# Altium project V3.PrjPcb (part 3 of 4)
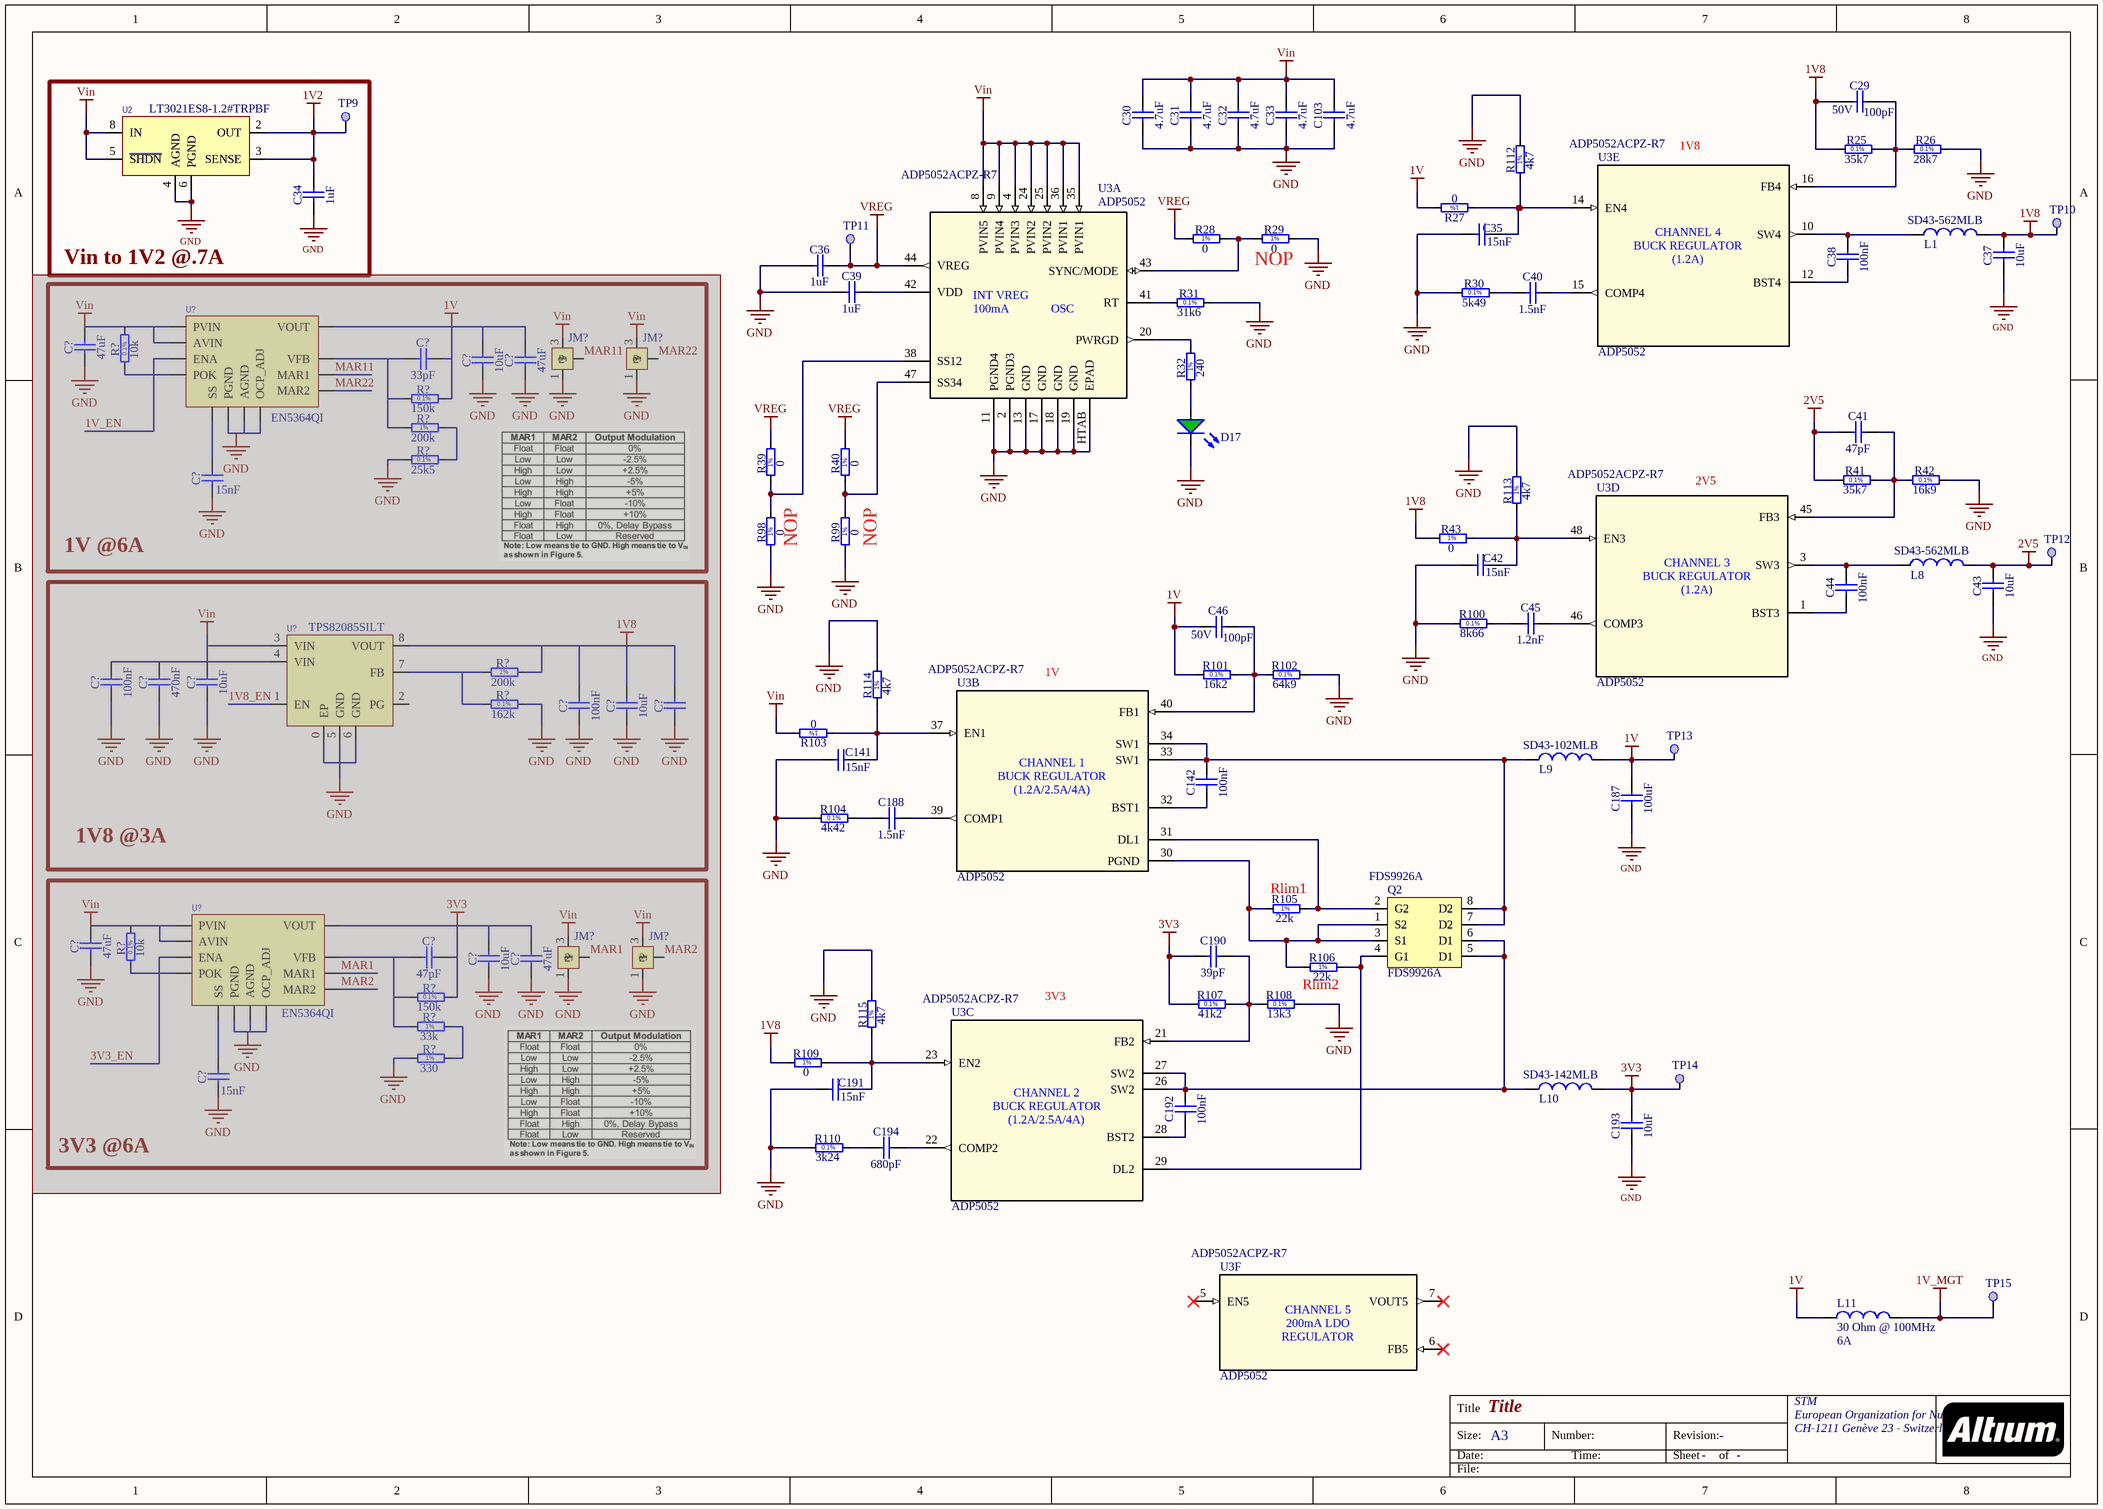
[diagram p6: Power.SchDoc]

## Sheet Power.SchDoc: Title (continued)
### Library data of the parts
C29 C46 = CC0603_100PF_50V_5%_NP0: Non-polarised capacitor; Part Description: SMD Multilayer Chip Ceramic Capacitor; Manufacturer: Kemet; Manufacturer Part Number: C0603C101J5GACTU; Manufacturer1 Part Number: 223886715101; TC: NP0; Tolerance: ±5%; Table: Capacitors SMD; Description: CAP CER 100PF 50V NP0 0603; Temperature Coefficient: C0G, NP0; Part Number: CC0603_100PF_50V_5%_NP0; Component Kind: Standard; Component Type: Standard; Pin Count: 2; Value: 100pF; Status: Preferred; Case: 0603; Mounted: Yes; Socket: No; SMD: Yes; Manufacturer1 Example: PHYCOMP; Manufacturer1 ComponentHeight: 0.87mm; HelpURL: \\cern.ch\dfs\Applications\Altium\Datasheets\CC0603_NP0_PHYCOMP.pdf; Author: CERN DEM JLC; CreateDate: 03.12.2007; LatestRevisionDate: 03.12.2007; Thickness (Max): 0.034" (0.87mm); Package / Case: 0603 (1608 Metric); Applications: General Purpose; Lead Style: -; Ratings: -; Packaging: Digi-Reel®; Category: Capacitors; RoHS: RoHS Compliant; Operating Temperature: -55°C ~ 125°C; Supplier: Digi-Key; Mounting Type: Surface Mount, MLCC; Features: Low ESL; Supplier Part Number: 399-1061-6-ND; Voltage - Rated: 50V; Size / Dimension: 0.063" L x 0.031" W (1.60mm x 0.80mm); Height - Seated (Max): -; Capacitance: 100pF; Lead Spacing: -
C30-C33 C103 = CC0805_4.7UF_10V_10%_X5R: Non-polarised capacitor; Part Description: SMD Multilayer Chip Ceramic Capacitor; Manufacturer: TDK; Manufacturer Part Number: C2012X7R1E475K125AB; Manufacturer1 Part Number: 222224013672; Voltage: 10V; TC: X5R; Tolerance: ±10%; Table: Capacitors SMD; SVHC: No SVHC (15-Jun-2015)<!--FANDB--><div class="features-and-benefits-container"><div class="features-and-benefits-description"><span class="features-benefits-value">The TDK C series commercial grade multilayer ceramic chip capacitor is Class 2, X7R dielectric material with perfect layering technique which ensures the precise placing of dielectric and electrode layers as well as the multilayer technology. High capacitance has been achieved through precision technologies that enable the use of multiple thinner ceramic dielectric layers. Typical applications include smoothing and decoupling circuits.</span></div><div class="features-and-benefits-list"><ul class="features-and-benefits-list-list"><li class="features-and-benefits-list-item">Capacitance values ranging from 0.5pF to 100µF based on dielectric material</li><li class="features-and-benefits-list-item">Case sizes 0402, 0603, 1005, 1608, 2012, 3216, 3225, 4532 and 5750 are available</li><li class="features-and-benefits-list-item">DC voltage rating of 4V to 50V</li><li class="features-and-benefits-list-item">Low ESL and excellent frequency characteristics</li><li class="features-and-benefits-list-item">Low self heating and high ripple resistance due to low ESR</li><li class="features-and-benefits-list-item">High temperature range of -55°C to 125; Capacitance: 4.7; Voltage Rating: 25; Product Range: C Series; Capacitance Tolerance: ± 10%; Ceramic Capacitor Case: 0805 [2012 Metric]; Dielectric Characteristic: X7; Description: TDK - C2012X7R1E475K125AB - CAP, MLCC, X7R, 4.7UF, 25V, 0805; Part Number: CC0805_4.7UF_10V_10%_X5R; Component Kind: Standard; Component Type: Standard; Pin Count: 2; Value: 4.7uF; Status: Preferred; Case: 0805; Mounted: Yes; Socket: No; SMD: Yes; Manufacturer1 Example: PHYCOMP; Manufacturer1 ComponentHeight: 1.45mm; HelpURL: \\cern.ch\dfs\Applications\Altium\Datasheets\CC0805_X5R_PHYCOMP_HC.pdf; Author: CERN DEM JLC; CreateDate: 03.12.2007; LatestRevisionDate: 03.12.2007; Operating Temperature Max: 125; Supplier Part Number: 2346943; RoHS: YES; Packaging: Cut Tape; Supplier: Farnell; Operating Temperature Min: -55; MSL: -
C34 = CC0603_1UF_25V_10%_X7R: Non-polarised capacitor; Part Description: SMD Multilayer Chip Ceramic Capacitor; Manufacturer: Murata Electronics North America; Manufacturer Part Number: GRM188R71E105KA12D; Voltage: 25V; TC: X7R; Tolerance: ±10%; Table: Capacitors SMD; Capacitance: 1µF; Description: CAP CER 1UF 25V X7R 0603; Part Number: CC0603_1UF_25V_10%_X7R; Component Kind: Standard; Component Type: Standard; Pin Count: 2; Value: 1uF; Status: None; Case: 0603; Mounted: Yes; Socket: No; SMD: Yes; Manufacturer1 Example: MURATA; Manufacturer1 Part Number: GRM188R71E105KA12D; Manufacturer1 ComponentHeight: 0.9mm; HelpURL: \\cern.ch\dfs\Applications\Altium\Datasheets\CC0603_X7R_MURATA.pdf; Author: CERN DEM JLC; CreateDate: 18.01.2011; LatestRevisionDate: 18.01.2011; Supplier Part Number: 490-5307-1-ND; Lead Style: -; Size / Dimension: 0.063" L x 0.031" W (1.60mm x 0.80mm); Mounting Type: Surface Mount, MLCC; Package / Case: 0603 (1608 Metric); Ratings: -; Operating Temperature: -55°C ~ 125°C; Category: Capacitors; Applications: General Purpose; Packaging: Cut Tape (CT); Features: -; Thickness (Max): 0.035" (0.90mm); Voltage - Rated: 25V; Temperature Coefficient: X7R; Height - Seated (Max): -; Supplier: Digi-Key; RoHS: RoHS Compliant; Lead Spacing: -
C35 C42 C141 C191 = CC0603_15NF_50V_10%_X7R: Non-polarised capacitor; Part Description: SMD Multilayer Chip Ceramic Capacitor; Manufacturer: AVX; Manufacturer Part Number: 06035C153KAZ2A; Manufacturer1 Part Number: 223858615638; Voltage: 50V; TC: X7R; Tolerance: ±10%; Table: Capacitors SMD; Dielectric Characteristic: X7; External Width: 1.6; Capacitance Tolerance: ± 10%; Product Range: FLEXITERM Series; External Depth: 0.81; No. of Pins: 2; SVHC: No SVHC (17-Dec-2015); Voltage Rating: 50; External Length / Height: 0.35; Capacitance: 0.015; Description: AVX - 06035C153KAZ2A - CAP, MLCC, X7R, 15NF, 50V, 0603; Ceramic Capacitor Case: 0603 [1608 Metric]; Capacitor Terminals: SMD; Part Number: CC0603_15NF_50V_10%_X7R; Component Kind: Standard; Component Type: Standard; Pin Count: 2; Value: 15nF; Status: Preferred; Case: 0603; Mounted: Yes; Socket: No; SMD: Yes; Manufacturer1 Example: PHYCOMP; Manufacturer1 ComponentHeight: 0.87mm; HelpURL: \\cern.ch\dfs\Applications\Altium\Datasheets\CC0603_X7R_PHYCOMP.pdf; Author: CERN DEM JLC; CreateDate: 3.12.2007; LatestRevisionDate: 3.12.2007; Capacitance Tolerance ±: ± 10%; Supplier: Farnell; RoHS: YES; Packaging: Cut Tape; Operating Temperature Max: 125; Operating Temperature Range: -55°C to +125°C<!--FANDB--><div class="features-and-benefits-container"><div class="features-and-benefits-description"><span class="features-benefits-value">The AVX FLEXITERM commercial MLCC are multilayer ceramic chip capacitors with X7R dielectric material and flexible terminations. The capacitance value ranges from 100pF to 22?F. FLEXITERM is designed to enhance mechanical flexure and temperature cycling performance of a standard ceramic capacitor. The industry standard for flexure is 2mm, FLEXITERM provides up to 5mm of flexure without internal cracks. These capacitors provide improved performance compared to standard termination capacitors. Typical applications include high flexure stress circuit boards and engine sensors.</span></div><div class="features-and-benefits-list"><ul class="features-and-benefits-list-list"><li class="features-and-benefits-list-item">EIA 0603, 0805, 1206, 1210, 1812, 2220 case sizes available</li><li class="features-and-benefits-list-item">Rated voltage of 10VDC, 16VDC, 25VDC, 50VDC, 100VDC and 200VDC</li><li class="features-and-benefits-list-item">±5%, ±10% and ±20% tolerance</li><li class="features-and-benefits-list-item">Flexible termination system</li><li class="features-and-benefits-list-item">Reduction in circuit board flex failures</li><li class="features-and-benefits-list-item">Soft termination offers improved reliability performance</li><li class="features-and-benefits-list-item">Operating temperature range -55°C to 125; Supplier Part Number: 1740537; Operating Temperature Min: -55; MSL: MSL 1 - Unlimited
C36 C39 = CC0603_1UF_16V_10%_X7R: Non-polarised capacitor; Part Description: SMD Multilayer Chip Ceramic Capacitor; Manufacturer: Murata Electronics North America; Manufacturer Part Number: GRM188R71E105KA12D; Manufacturer1 Part Number: 223824613663; Voltage: 16V; TC: X7R; Tolerance: ±10%; Table: Capacitors SMD; Capacitance: 1µF; Voltage - Rated: 25V; Description: CAP CER 1UF 25V X7R 0603; Part Number: CC0603_1UF_16V_10%_X7R; Component Kind: Standard; Component Type: Standard; Pin Count: 2; Value: 1uF; Status: Preferred; Case: 0603; Mounted: Yes; Socket: No; SMD: Yes; Manufacturer1 Example: PHYCOMP; Manufacturer1 ComponentHeight: 0.87mm; HelpURL: \\cern.ch\dfs\Applications\Altium\Datasheets\CC0805_X5R_PHYCOMP_HC.pdf; Author: CERN DEM JLC; CreateDate: 03.12.2007; LatestRevisionDate: 03.12.2007; Supplier Part Number: 490-5307-1-ND; Lead Style: -; Size / Dimension: 0.063" L x 0.031" W (1.60mm x 0.80mm); Mounting Type: Surface Mount, MLCC; Package / Case: 0603 (1608 Metric); Ratings: -; Operating Temperature: -55°C ~ 125°C; Category: Capacitors; Applications: General Purpose; Packaging: Cut Tape (CT); Features: -; Thickness (Max): 0.035" (0.90mm); Temperature Coefficient: X7R; Height - Seated (Max): -; Supplier: Digi-Key; RoHS: RoHS Compliant; Lead Spacing: -
C37 C43 C193 = CC1206_10UF_16V_10%_X7R: Non-polarised capacitor; Part Description: SMD Multilayer Chip Ceramic Capacitor; Manufacturer: Kemet; Manufacturer Part Number: C1206C106K4RACTU; Manufacturer1 Part Number: C1206C106K4RAC; Voltage: 16V; TC: X7R; Tolerance: ±10%; Table: Capacitors SMD; Description: CAP CER 10UF 16V X7R 1206; Capacitance: 10µF; Part Number: CC1206_10UF_16V_10%_X7R; Component Kind: Standard; Component Type: Standard; Pin Count: 2; Value: 10uF; Status: Preferred; Case: 1206; Mounted: Yes; Socket: No; SMD: Yes; Manufacturer1 Example: KEMET; Manufacturer1 ComponentHeight: 1.8mm; HelpURL: \\cern.ch\dfs\Applications\Altium\Datasheets\CC1206_X7R_KEMET.pdf; Author: CERN DEM JLC; CreateDate: 28.04.2009; LatestRevisionDate: 28.04.2009; Operating Temperature: -55°C ~ 125°C; Category: Capacitors; Temperature Coefficient: X7R; Thickness (Max): 0.071" (1.80mm); Lead Style: -; Ratings: -; Lead Spacing: -; Height - Seated (Max): -; Applications: General Purpose; Size / Dimension: 0.126" L x 0.063" W (3.20mm x 1.60mm); Voltage - Rated: 16V; Supplier Part Number: 399-3525-1-ND; RoHS: RoHS Compliant; Mounting Type: Surface Mount, MLCC; Package / Case: 1206 (3216 Metric); Packaging: Cut Tape (CT); Features: -; Supplier: Digi-Key
C38 C44 C142 C192 = CC0603_100NF_50V_10%_X7R: Non-polarised capacitor; Part Description: SMD Multilayer Chip Ceramic Capacitor; Manufacturer: MULTICOMP; Manufacturer Part Number: MCB0603R104KCT; Manufacturer1 Part Number: 223858615649; Voltage: 50V; TC: X7R; Tolerance: ±10%; Table: Capacitors SMD; Voltage Rating: 16; Capacitance Tolerance ±: ± 10%; Dielectric Characteristic: X7; Capacitance: 0.1; Description: MULTICOMP - MCB0603R104KCT - CAP, MLCC, X7R, 100NF, 16V, 0603; SVHC: No SVHC (17-Dec-2015); Capacitor Terminals: SMD; Ceramic Capacitor Case: 0603 [1608 Metric]; Product Range: MCB Series; Part Number: CC0603_100NF_50V_10%_X7R; Component Kind: Standard; Component Type: Standard; Pin Count: 2; Value: 100nF; Status: Preferred; Case: 0603; Mounted: Yes; Socket: No; SMD: Yes; Manufacturer1 Example: PHYCOMP; Manufacturer1 ComponentHeight: 0.87mm; HelpURL: \\cern.ch\dfs\Applications\Altium\Datasheets\CC0603_X7R_PHYCOMP.pdf; Author: CERN DEM JLC; CreateDate: 03.12.2007; LatestRevisionDate: 03.12.2007; Supplier: Farnell; Capacitance Tolerance: ± 10%; Supplier Part Number: 9406140; RoHS: YES; Packaging: Cut Tape; MSL: -; Operating Temperature Max: 125; Operating Temperature Range: -55°C to +125°C<!--FANDB--><div class="features-and-benefits-container"><div class="features-and-benefits-description"><span class="features-benefits-value">The MCB0603R104KCT is a multilayer Ceramic Capacitor with 0603 chip, for general digital circuit. Consists of a conducting material and electrodes. To manufacture a chip-type SMT and achieve miniaturization, high density and high efficiency, ceramic condensers are used. MLCC is made by X7; Operating Temperature Min: -55
C40 = CC0603_1.5NF_50V_10%_X7R: Non-polarised capacitor; Part Description: SMD Multilayer Chip Ceramic Capacitor; Manufacturer: MULTICOMP; Manufacturer Part Number: MC0603B152K500CT; Manufacturer1 Part Number: 223858615625; Voltage: 50V; TC: X7R; Tolerance: ±10%; Table: Capacitors SMD; Capacitance Tolerance: ± 10%; Capacitance: 1500; Dielectric Characteristic: X7; External Depth: 1.6; SVHC: No SVHC (17-Dec-2015); No. of Pins: 2; Voltage Rating: 50; Product Range: MC Series; Ceramic Capacitor Case: 0603 [1608 Metric]; Capacitor Terminals: SMD; External Width: 0.8; Description: MULTICOMP - MC0603B152K500CT - CAP, MLCC, X7R, 1.5NF, 50V, 0603; Part Number: CC0603_1.5NF_50V_10%_X7R; Component Kind: Standard; Component Type: Standard; Pin Count: 2; Value: 1.5nF; Status: Preferred; Case: 0603; Mounted: Yes; Socket: No; SMD: Yes; Manufacturer1 Example: PHYCOMP; Manufacturer1 ComponentHeight: 0.87mm; HelpURL: \\cern.ch\dfs\Applications\Altium\Datasheets\CC0603_X7R_PHYCOMP.pdf; Author: CERN DEM JLC; CreateDate: 3.12.2007; LatestRevisionDate: 3.12.2007; RoHS: YES; Operating Temperature Range: -55°C to +125°C<!--FANDB--><div class="features-and-benefits-container"><div class="features-and-benefits-description"><span class="features-benefits-value">The Multicomp MC series is general purpose MLCC capacitors with X7R dielectric material which provides high electrical precision, stability and reliability. This MLCC capacitor consists of a conducting material and electrodes with high density and high efficiency ceramic condensers.</span></div><div class="features-and-benefits-list"><ul class="features-and-benefits-list-list"><li class="features-and-benefits-list-item">Small size with higher capacitance values</li><li class="features-and-benefits-list-item">0201, 0402, 0603, 0805, 1206, 1210, 1812 case sizes available</li><li class="features-and-benefits-list-item">Capacitance value ranging from 100pF to 47?F</li><li class="features-and-benefits-list-item">Capacitor with lead free termination (pure Tin)</li><li class="features-and-benefits-list-item">High electrical precision, stability and reliability</li><li class="features-and-benefits-list-item">Rated voltage of 6.3V, 10V, 16V, 25V, 50V, 100V</li><li class="features-and-benefits-list-item">Operating temperature of -55°C to +125°C</li><li class="features-and-benefits-list-item">Available in ±5%, ±10% and ±20; MSL: -; Operating Temperature Max: 125; Packaging: Cut Tape; Operating Temperature Min: -55; Capacitance Tolerance ±: ± 10%; Supplier Part Number: 1759091; External Length / Height: 0.8; Supplier: Farnell
C41 = CC0603_47PF_50V_5%_NP0: Non-polarised capacitor; Part Description: SMD Multilayer Chip Ceramic Capacitor; Manufacturer: AVX Corporation; Manufacturer Part Number: 06031A470FAT2A; Manufacturer1 Part Number: 223886715479; Voltage: 50V; TC: NP0; Tolerance: ±1%; Table: Capacitors SMD; Temperature Coefficient: C0G, NP0; Description: CAP CER 47PF 100V NP0 0603; Voltage - Rated: 100V; Part Number: CC0603_47PF_50V_5%_NP0; Component Kind: Standard; Component Type: Standard; Pin Count: 2; Value: 47pF; Status: Preferred; Case: 0603; Mounted: Yes; Socket: No; SMD: Yes; Manufacturer1 Example: PHYCOMP; Manufacturer1 ComponentHeight: 0.87mm; HelpURL: \\cern.ch\dfs\Applications\Altium\Datasheets\CC0603_NP0_PHYCOMP.pdf; Author: CERN DEM JLC; CreateDate: 3.12.2007; LatestRevisionDate: 3.12.2007; Features: -; Lead Style: -; Mounting Type: Surface Mount, MLCC; Applications: General Purpose; Thickness (Max): 0.035" (0.90mm); Package / Case: 0603 (1608 Metric); Capacitance: 47pF; Category: Capacitors; Supplier Part Number: 478-3691-1-ND; Operating Temperature: -55°C ~ 125°C; Size / Dimension: 0.063" L x 0.032" W (1.60mm x 0.81mm); Ratings: -; Lead Spacing: -; Supplier: Digi-Key; Packaging: Cut Tape (CT); RoHS: RoHS Compliant; Height - Seated (Max): -
C45 = CPPS0603_1.2NF_16V_5%_PANASONIC_ECHU(X): Non-polarised capacitor; Part Description: Stacked Metallized PPS (Polyphenylene Sulfide) Film Chip Capacitor; Manufacturer: MULTICOMP; Manufacturer Part Number: MC0603B122K500CT; Voltage: 16V; Tolerance: ±5%; Table: Capacitors SMD; Capacitance Tolerance ±: ± 10%; External Depth: 1.6; External Width: 0.8; Capacitor Terminals: SMD; Description: MULTICOMP - MC0603B122K500CT - CAP, MLCC, X7R, 1.2NF, 50V, 0603; Voltage Rating: 50; Ceramic Capacitor Case: 0603 [1608 Metric]; Dielectric Characteristic: X7; SVHC: No SVHC (17-Dec-2015); Capacitance: 1200; Product Range: MC Series; No. of Pins: 2; Part Number: CPPS0603_1.2NF_16V_5%_PANASONIC_ECHU(X); Component Kind: Standard; Component Type: Standard; Pin Count: 2; Value: 1.2nF; Status: None; Case: 0603; Mounted: Yes; Socket: No; SMD: Yes; HelpURL: \\cern.ch\dfs\Applications\Altium\Datasheets\CPPS0603_PANASONIC_ECHU(X).pdf; Author: CERN DEM JLC; CreateDate: 15.06.2011; LatestRevisionDate: 15.06.2011; ComponentHeight: 0.85mm; Supplier: Farnell; Supplier Part Number: 1759090; Operating Temperature Max: 125; Packaging: Cut Tape; MSL: -; Capacitance Tolerance: ± 10%; Operating Temperature Range: -55°C to +125; External Length / Height: 0.8; Operating Temperature Min: -55; RoHS: YES
C187 = CC1210_100UF_6.3V_20%_X5R: Non-polarised capacitor; Part Description: SMD Multilayer Chip Ceramic Capacitor; Manufacturer: Murata Electronics North America; Manufacturer Part Number: GRM32ER60J107ME20L; Voltage: 6.3V; TC: X5R; Tolerance: ±20%; Table: Capacitors SMD; Capacitance: 100µF; Description: CAP CER 100UF 6.3V X5R 1210; Part Number: CC1210_100UF_6.3V_20%_X5R; Component Kind: Standard; Component Type: Standard; Pin Count: 2; Value: 100uF; Status: Preferred; Case: 1210; Mounted: Yes; Socket: No; SMD: Yes; Manufacturer1 Example: MURATA; Manufacturer1 Part Number: GRM32ER60J107ME20L; Manufacturer1 ComponentHeight: 2.70mm; HelpURL: \\cern.ch\dfs\Applications\Altium\Datasheets\CC1210_X5R_MURATA.pdf; Author: CERN DEM JLC; CreateDate: 19.04.2010; LatestRevisionDate: 19.04.2010; Supplier: Digi-Key; Thickness (Max): 0.106" (2.70mm); Package / Case: 1210 (3225 Metric); Supplier Part Number: 490-3390-2-ND; Features: -; Mounting Type: Surface Mount, MLCC; Operating Temperature: -55°C ~ 85°C; Applications: General Purpose; Size / Dimension: 0.126" L x 0.098" W (3.20mm x 2.50mm); Category: Capacitors; Lead Style: -; Height - Seated (Max): -; Lead Spacing: -; RoHS: RoHS Compliant; Temperature Coefficient: X5R; Voltage - Rated: 6.3V; Packaging: Tape & Reel (TR); Ratings: -
C188 = CC0603_1.5NF_50V_5%_NP0: Non-polarised capacitor; Part Description: SMD Multilayer Chip Ceramic Capacitor; Manufacturer: KEMET; Manufacturer Part Number: C0603C152K5RACTU; Manufacturer1 Part Number: GRM1885C1H152JA01D; Voltage: 50V; TC: NP0; Tolerance: ±5%; Table: Capacitors SMD; Description: KEMET - C0603C152K5RACTU - CAP, MLCC, X7R, 1.5NF, 50V, 0603; Part Number: CC0603_1.5NF_50V_5%_NP0; Component Kind: Standard; Component Type: Standard; Pin Count: 2; Value: 1.5nF; Status: None; Case: 0603; Mounted: Yes; Socket: No; SMD: Yes; Manufacturer1 Example: MURATA; Manufacturer1 ComponentHeight: 0.9mm; HelpURL: \\cern.ch\dfs\Applications\Altium\Datasheets\CC0603_NP0_MURATA.pdf; Author: CERN DEM JLC; CreateDate: 08.02.2011; LatestRevisionDate: 08.02.2011; Supplier: Farnell; RoHS: YES; Supplier Part Number: 1414617
C190 = CC0603_39PF_50V_5%_NP0: Non-polarised capacitor; Part Description: SMD Multilayer Chip Ceramic Capacitor; Manufacturer: AVX Corporation; Manufacturer Part Number: 06031A390FAT2A; Manufacturer1 Part Number: 223886715399; Voltage: 50V; TC: NP0; Tolerance: ±1%; Table: Capacitors SMD; Temperature Coefficient: C0G, NP0; Description: CAP CER 39PF 100V NP0 0603; Voltage - Rated: 100V; Part Number: CC0603_39PF_50V_5%_NP0; Component Kind: Standard; Component Type: Standard; Pin Count: 2; Value: 39pF; Status: Preferred; Case: 0603; Mounted: Yes; Socket: No; SMD: Yes; Manufacturer1 Example: PHYCOMP; Manufacturer1 ComponentHeight: 0.87mm; HelpURL: \\cern.ch\dfs\Applications\Altium\Datasheets\CC0603_NP0_PHYCOMP.pdf; Author: CERN DEM JLC; CreateDate: 03.12.2007; LatestRevisionDate: 03.12.2007; RoHS: RoHS Compliant; Thickness (Max): 0.035" (0.90mm); Features: -; Package / Case: 0603 (1608 Metric); Supplier Part Number: 478-5773-1-ND; Lead Style: -; Supplier: Digi-Key; Category: Capacitors; Lead Spacing: -; Capacitance: 39pF; Size / Dimension: 0.063" L x 0.032" W (1.60mm x 0.81mm); Packaging: Cut Tape (CT); Operating Temperature: -55°C ~ 125°C; Applications: General Purpose; Mounting Type: Surface Mount, MLCC; Ratings: -; Height - Seated (Max): -
C194 = CC0603_680PF_50V_5%_NP0: Non-polarised capacitor; Part Description: SMD Multilayer Chip Ceramic Capacitor; Manufacturer: Kemet; Manufacturer Part Number: C0603C681F5GACTU; Manufacturer1 Part Number: 223886715681; Voltage: 50V; TC: NP0; Tolerance: ±1%; Table: Capacitors SMD; Description: CAP CER 680PF 50V NP0 0603; Temperature Coefficient: C0G, NP0; Part Number: CC0603_680PF_50V_5%_NP0; Component Kind: Standard; Component Type: Standard; Pin Count: 2; Value: 680pF; Status: Preferred; Case: 0603; Mounted: Yes; Socket: No; SMD: Yes; Manufacturer1 Example: PHYCOMP; Manufacturer1 ComponentHeight: 0.87mm; HelpURL: \\cern.ch\dfs\Applications\Altium\Datasheets\CC0603_NP0_PHYCOMP.pdf; Author: CERN DEM JLC; CreateDate: 03.12.2007; LatestRevisionDate: 03.12.2007; RoHS: RoHS Compliant; Voltage - Rated: 50V; Size / Dimension: 0.063" L x 0.031" W (1.60mm x 0.80mm); Supplier Part Number: 399-7948-1-ND; Lead Spacing: -; Packaging: Cut Tape (CT); Supplier: Digi-Key; Features: Low ESL; Thickness (Max): 0.034" (0.87mm); Ratings: -; Mounting Type: Surface Mount, MLCC; Height - Seated (Max): -; Applications: General Purpose; Capacitance: 680pF; Lead Style: -; Package / Case: 0603 (1608 Metric); Operating Temperature: -55°C ~ 125°C; Category: Capacitors
C?#1 = CC0603_33PF_50V_5%_NP0: Non-polarised capacitor; Part Description: SMD Multilayer Chip Ceramic Capacitor; Manufacturer: GENERIC; Manufacturer1 Part Number: 223886715339; Voltage: 50V; TC: NP0; Tolerance: ±5%; Table: Capacitors SMD; Part Number: CC0603_33PF_50V_5%_NP0; Component Kind: Standard; Component Type: Standard; Pin Count: 2; Value: 33pF; Status: Preferred; Manufacturer Part Number: CC0603_33PF_50V_5%_NP0; Case: 0603; Mounted: Yes; Socket: No; SMD: Yes; Manufacturer1 Example: PHYCOMP; Manufacturer1 ComponentHeight: 0.87mm; HelpURL: \\cern.ch\dfs\Applications\Altium\Datasheets\CC0603_NP0_PHYCOMP.pdf; Author: CERN DEM JLC; CreateDate: 3.12.2007; LatestRevisionDate: 3.12.2007
C?#2 C?#4 C?#13 C?#15 = CC1210_47UF_10V_20%_X5R: Non-polarised capacitor; Part Description: SMD Multilayer Chip Ceramic Capacitor; Manufacturer: GENERIC; Manufacturer1 Part Number: LMK325BJ476MM-T; Voltage: 10V; TC: X5R; Tolerance: ±20%; Table: Capacitors SMD; Part Number: CC1210_47UF_10V_20%_X5R; Component Kind: Standard; Component Type: Standard; Pin Count: 2; Value: 47uF; Status: None; Manufacturer Part Number: CC1210_47UF_10V_20%_X5R; Case: 1210; Mounted: Yes; Socket: No; SMD: Yes; Manufacturer1 Example: TAIYO YUDEN; Manufacturer1 ComponentHeight: 2.7mm; HelpURL: \\cern.ch\dfs\Applications\Altium\Datasheets\CC1210_X5R_TAIYO-YUDEN_HIGH-VALUE.pdf; Author: CERN DEM JLC; CreateDate: 4.05.2011; LatestRevisionDate: 4.05.2011
C?#3 C?#8 C?#14 = CC0805_10UF_10V_10%_X7R: Non-polarised capacitor; Part Description: SMD Multilayer Chip Ceramic Capacitor; Manufacturer: GENERIC; Manufacturer1 Part Number: GRM21BR71A106KE51L; Voltage: 10V; TC: X7R; Tolerance: ±10%; Table: Capacitors SMD; Part Number: CC0805_10UF_10V_10%_X7R; Component Kind: Standard; Component Type: Standard; Pin Count: 2; Value: 10uF; Status: Preferred; Manufacturer Part Number: CC0805_10UF_10V_10%_X7R; Case: 0805; Mounted: Yes; Socket: No; SMD: Yes; Manufacturer1 Example: MURATA; Manufacturer1 ComponentHeight: 1.35mm; HelpURL: \\cern.ch\dfs\Applications\Altium\Datasheets\CC0805_X7R_MURATA.pdf; Author: CERN DEM JLC; CreateDate: 30.04.2012; LatestRevisionDate: 30.04.2012
C?#5 C?#16 = CC0603_15NF_50V_10%_X7R: Non-polarised capacitor; Part Description: SMD Multilayer Chip Ceramic Capacitor; Manufacturer: GENERIC; Manufacturer1 Part Number: 223858615638; Voltage: 50V; TC: X7R; Tolerance: ±10%; Table: Capacitors SMD; Part Number: CC0603_15NF_50V_10%_X7R; Component Kind: Standard; Component Type: Standard; Pin Count: 2; Value: 15nF; Status: Preferred; Manufacturer Part Number: CC0603_15NF_50V_10%_X7R; Case: 0603; Mounted: Yes; Socket: No; SMD: Yes; Manufacturer1 Example: PHYCOMP; Manufacturer1 ComponentHeight: 0.87mm; HelpURL: \\cern.ch\dfs\Applications\Altium\Datasheets\CC0603_X7R_PHYCOMP.pdf; Author: CERN DEM JLC; CreateDate: 3.12.2007; LatestRevisionDate: 3.12.2007
C?#6 C?#9 = CC0603_100NF_50V_10%_X7R: Non-polarised capacitor; Part Description: SMD Multilayer Chip Ceramic Capacitor; Manufacturer: GENERIC; Manufacturer1 Part Number: 223858615649; Voltage: 50V; TC: X7R; Tolerance: ±10%; Table: Capacitors SMD; Part Number: CC0603_100NF_50V_10%_X7R; Component Kind: Standard; Component Type: Standard; Pin Count: 2; Value: 100nF; Status: Preferred; Manufacturer Part Number: CC0603_100NF_50V_10%_X7R; Case: 0603; Mounted: Yes; Socket: No; SMD: Yes; Manufacturer1 Example: PHYCOMP; Manufacturer1 ComponentHeight: 0.87mm; HelpURL: \\cern.ch\dfs\Applications\Altium\Datasheets\CC0603_X7R_PHYCOMP.pdf; Author: CERN DEM JLC; CreateDate: 3.12.2007; LatestRevisionDate: 3.12.2007
C?#7 = CC0603_470NF_16V_10%_X5R: Non-polarised capacitor; Part Description: SMD Multilayer Chip Ceramic Capacitor; Manufacturer: GENERIC; Manufacturer1 Part Number: 223878613658; Voltage: 16V; TC: X5R; Tolerance: ±10%; Table: Capacitors SMD; Part Number: CC0603_470NF_16V_10%_X5R; Component Kind: Standard; Component Type: Standard; Pin Count: 2; Value: 470nF; Status: Preferred; Manufacturer Part Number: CC0603_470NF_16V_10%_X5R; Case: 0603; Mounted: Yes; Socket: No; SMD: Yes; Manufacturer1 Example: PHYCOMP; Manufacturer1 ComponentHeight: 0.87mm; HelpURL: \\cern.ch\dfs\Applications\Altium\Datasheets\CC0805_X5R_PHYCOMP_HC.pdf; Author: CERN DEM JLC; CreateDate: 3.12.2007; LatestRevisionDate: 3.12.2007
C?#10 = CC0603_10UF_6.3V_20%_X5R: Non-polarised capacitor; Part Description: SMD Multilayer Chip Ceramic Capacitor; Manufacturer: GENERIC; Manufacturer1 Part Number: C0603C106M9PAC; Voltage: 6.3V; TC: X5R; Tolerance: ±20%; Table: Capacitors SMD; Part Number: CC0603_10UF_6.3V_20%_X5R; Component Kind: Standard; Component Type: Standard; Pin Count: 2; Value: 10uF; Status: Preferred; Manufacturer Part Number: CC0603_10uF_6.3V_20%_X5R; Case: 0603; Mounted: Yes; Socket: No; SMD: Yes; Manufacturer1 Example: KEMET; Manufacturer1 ComponentHeight: 0.95mm; HelpURL: \\cern.ch\dfs\Applications\Altium\Datasheets\CC0603_X5R_KEMET.pdf; Author: CERN DEM JLC; CreateDate: 3.12.2007; LatestRevisionDate: 3.12.2007
C?#11 = CC0805_22UF_16V_10%_X5R: Non-polarised capacitor; Part Description: SMD Multilayer Chip Ceramic Capacitor; Manufacturer: GENERIC; Manufacturer1 Part Number: C2012X5R1C226KT; Voltage: 16V; TC: X5R; Tolerance: ±10%; Table: Capacitors SMD; Part Number: CC0805_22UF_16V_10%_X5R; Component Kind: Standard; Component Type: Standard; Pin Count: 2; Value: 22uF; Status: Preferred; Manufacturer Part Number: CC0805_22UF_16V_10%_X5R; Case: 0805; Mounted: Yes; Socket: No; SMD: Yes; Manufacturer1 Example: TDK; Manufacturer1 ComponentHeight: 1.35mm; HelpURL: \\cern.ch\dfs\Applications\Altium\Datasheets\CC0805_X5R_TDK_C.pdf; Author: CERN DEM JLC; CreateDate: 25.10.2012; LatestRevisionDate: 25.10.2012
C?#12 = CC0603_47PF_50V_5%_NP0: Non-polarised capacitor; Part Description: SMD Multilayer Chip Ceramic Capacitor; Manufacturer: GENERIC; Manufacturer1 Part Number: 223886715479; Voltage: 50V; TC: NP0; Tolerance: ±5%; Table: Capacitors SMD; Part Number: CC0603_47PF_50V_5%_NP0; Component Kind: Standard; Component Type: Standard; Pin Count: 2; Value: 47pF; Status: Preferred; Manufacturer Part Number: CC0603_47PF_50V_5%_NP0; Case: 0603; Mounted: Yes; Socket: No; SMD: Yes; Manufacturer1 Example: PHYCOMP; Manufacturer1 ComponentHeight: 0.87mm; HelpURL: \\cern.ch\dfs\Applications\Altium\Datasheets\CC0603_NP0_PHYCOMP.pdf; Author: CERN DEM JLC; CreateDate: 3.12.2007; LatestRevisionDate: 3.12.2007
D17 = LED0603: Diode, LED, 0603, Green; Manufacturer Part Number: 5988070100F; Manufacturer: Dialight; Current - Test: 20mA; Voltage - Forward (Vf) (Typ): 3.2V; Lens Transparency: Clear; Lens Style/Size: Rectangle with Flat Top, 1.10mm x 0.80mm; Lens Color: Colorless; Viewing Angle: 140°; Millicandela Rating: 20mcd; Wavelength - Dominant: 566nm; Category: Optoelectronics; Wavelength - Peak: -; Supplier: Digi-Key; Supplier Device Package: *; Height (Max): 0.70mm; Size / Dimension: 1.60mm L x 0.80mm W; Mounting Type: Surface Mount; RoHS: RoHS Compliant; Package / Case: 0603 (1608 Metric); Packaging: Cut Strip; Color: Green; Supplier Part Number: 5988070100F-ND
L1 L8 = SD43: Shilded SMD Power Inductors; Manufacturer: COILCRAFT; Inductance: 5.6; Product Range: SD43 Series; Power Inductor Case: 4.7mm x 4.2mm x 3.45; Saturation Current (Isat): 2.2; RMS Current (Irms): 2.8; DC Resistance Max: 0.101; Inductor Construction: Unshielded; Inductance Tolerance: ± 20%; RoHS: YES; Packaging: Cut Tape; MSL: MSL 1 - Unlimited<!--FANDB--><div class="features-and-benefits-container"></div>; Supplier Part Number: 2526966; Supplier: Farnell
L9 = SD43: Shilded SMD Power Inductors; Manufacturer: COILCRAFT; Inductance: 1; Saturation Current (Isat): 5.5; Product Range: SD43 Series; Inductance Tolerance: ± 20%; Inductor Construction: Unshielded; DC Resistance Max: 0.033; Power Inductor Case: 4.7mm x 4.2mm x 3.45; RMS Current (Irms): 5.8; RoHS: YES; Packaging: Cut Tape; MSL: MSL 1 - Unlimited<!--FANDB--><div class="features-and-benefits-container"></div>; Supplier: Farnell; Supplier Part Number: 2526946
L10 = SD43: Shilded SMD Power Inductors; Manufacturer: COILCRAFT; DC Resistance Max: 0.038; Inductance: 1.4; Inductance Tolerance: ± 20%; Inductor Construction: Unshielded; Product Range: SD43 Series; RMS Current (Irms): 5.8; Power Inductor Case: 4.7mm x 4.2mm x 3.45; Saturation Current (Isat): 4.8; RoHS: YES; MSL: MSL 1 - Unlimited<!--FANDB--><div class="features-and-benefits-container"></div>; Packaging: Cut Tape; Supplier Part Number: 2526951; Supplier: Farnell
L11 = MPZ2012S300AT000: FERRITE CHIP 30 OHM 6A 0805; Manufacturer: TDK Corporation; ESP: DSB; DC Resistance (DCR): 10 mOhm Max; Filter Type: Differential Mode - Single; Package: 0402-A; RS Stock Code: EL1724-0001; Package / Case: 0805 (2012 Metric); Supplier: Digi-Key; Size / Dimension: 0.079" L x 0.049" W (2.00mm x 1.25mm); Mounting Type: Surface Mount; RoHS: RoHS Compliant; Manufacturer Part Number: MPZ2012S300AT000; Category: Filters; Height (Max): 0.041" (1.05mm); Packaging: Cut Tape (CT); Supplier Part Number: 445-1566-1-ND
Q2 = FDS9926A: Manufacturer: Fairchild Semiconductor; Rds On (Max) @ Id, Vgs: 30 mOhm @ 6.5A, 4.5V; FET Feature: Logic Level Gate; FET Type: 2 N-Channel (Dual); Gate Charge (Qg) @ Vgs: 9nC @ 4.5V; Current - Continuous Drain (Id) @ 25°C: 6.5A; Drain to Source Voltage (Vdss): 20V; Description: MOSFET 2N-CH 20V 6.5A 8SOIC; Power - Max: 900mW; Vgs(th) (Max) @ Id: 1.5V @ 250µA; Input Capacitance (Ciss) @ Vds: 650pF @ 10V; Supplier: Digi-Key; Supplier Part Number: FDS9926ATR-ND; RoHS: RoHS Compliant; Package / Case: 8-SOIC (0.154", 3.90mm Width); Mounting Type: Surface Mount; Operating Temperature: -55°C ~ 150°C (TJ); Supplier Device Package: 8-SO; Category: Discrete Semiconductor Products; Packaging: Tape & Reel (TR); Manufacturer Part Number: FDS9926A
R25 = R0603_35K7_0.1%_0.063W_10PPM: Resistor - 0.1%; Part Description: Thin Film Chip Resistor; Manufacturer: VISHAY; Manufacturer Part Number: CRCW060335K7FKEA.; Manufacturer1 Part Number: RN73C1J35K7BTDF; Power: 0.063W; TC: ±10ppm; Table: Resistors SMD; Product Range: AEC-Q200 CRCW Series; Resistor Mounting: Surface Mount Device<!--FANDB--><div class="features-and-benefits-container"><div class="features-and-benefits-description"><span class="features-benefits-value">The Vishay D/CRCW e3 series are standard thick film chip resistors. The resistance range includes E96 and E24 decade values from 1ohm to 10Mohm. CRCW e3 series resistors have a pure tin solder contacts on the Ni barrier layer that provides compatibility with reflow soldering process.</span></div><div class="features-and-benefits-list"><ul class="features-and-benefits-list-list"><li class="features-and-benefits-list-item">Automotive grade AEC-Q200 qualified</li><li class="features-and-benefits-list-item">EIA 0402, 0603, 0805, 1206, 1210, 1218, 2010, 2512 standard case sizes available</li><li class="features-and-benefits-list-item">Stability &Delta; Temperature Coefficient: ± 100; Resistor Element Material: Thick Film; Voltage Rating: 75; Resistance Tolerance: ± 1%; Power Rating: 100; Resistance: 35.7; Description: VISHAY - CRCW060335K7FKEA. - RES, THICK FILM, 35K7, 1%, 0.1W, 0603; Resistor Case Style: 0603 [1608 Metric]; Part Number: R0603_35K7_0.1%_0.063W_10PPM; Component Kind: Standard; Component Type: Standard; Pin Count: 2; Value: 35k7; Status: Not recommended; Tolerance: ±0.1%; Case: 0603; Mounted: Yes; Socket: No; SMD: Yes; Manufacturer1 Example: TYCO HOLSWORTHY; Manufacturer1 ComponentHeight: 0.5mm; HelpURL: \\cern.ch\dfs\Applications\Altium\Datasheets\R0603_Tyco_RN73.pdf; Author: CERN DEM JLC; CreateDate: 3.12.2007; LatestRevisionDate: 13.03.2008; Supplier: Farnell; RoHS: Y-EX; MSL: MSL 1 - Unlimited; Supplier Part Number: 2138458; Packaging: Cut Tape
R26 = R0603_28K7_0.1%_0.063W_10PPM: Resistor - 0.1%; Part Description: Thin Film Chip Resistor; Manufacturer: Yageo; Manufacturer Part Number: RC0603FR-0728K7L; Manufacturer1 Part Number: RN73C1J28K7BTDF; Power: 0.063W; TC: ±10ppm; Tolerance: ±1%; Table: Resistors SMD; Temperature Coefficient: ±100ppm/°C; Resistance (Ohms): 28.7k; Power (Watts): 0.1W, 1/10W; Description: RES SMD 28.7K OHM 1% 1/10W 0603; Part Number: R0603_28K7_0.1%_0.063W_10PPM; Component Kind: Standard; Component Type: Standard; Pin Count: 2; Value: 28k7; Status: Not recommended; Case: 0603; Mounted: Yes; Socket: No; SMD: Yes; Manufacturer1 Example: TYCO HOLSWORTHY; Manufacturer1 ComponentHeight: 0.5mm; HelpURL: \\cern.ch\dfs\Applications\Altium\Datasheets\R0603_Tyco_RN73.pdf; Author: CERN DEM JLC; CreateDate: 3.12.2007; LatestRevisionDate: 13.03.2008; Package / Case: 0603 (1608 Metric); Category: Resistors; Height: 0.022" (0.55mm); Number of Terminations: 2; Packaging: Digi-Reel®; Supplier Part Number: 311-28.7KHRDKR-ND; Supplier Device Package: 0603; RoHS: RoHS Compliant; Size / Dimension: 0.063" L x 0.031" W (1.60mm x 0.80mm); Operating Temperature: -55°C ~ 155°C; Composition: Thick Film; Supplier: Digi-Key; Features: Moisture Resistant
R27-R29 R39 R40 R43 R98 R99 R103 R109 = R0603_0R_JUMPER: Resistor - 1%; Part Description: 1A (0.05R Max DC Resistance) Zero Ohm Jumper; Manufacturer: MULTICOMP; Manufacturer Part Number: MC0603SAF0000T5E; Manufacturer1 Part Number: NRC06Z0; Table: Resistors SMD; Description: MULTICOMP - MC0603SAF0000T5E - RES, THICK FILM, 0R, 1%, 0.1W, 0603; Part Number: R0603_0R_JUMPER; Component Kind: Standard; Component Type: Standard; Pin Count: 2; Value: 0; Status: Preferred; Case: 0603; Mounted: Yes; Socket: No; SMD: Yes; Manufacturer1 Example: NIC COMPONENT; Manufacturer1 ComponentHeight: 0.55mm; HelpURL: \\cern.ch\dfs\Applications\Altium\Datasheets\R0603_NIC_NRC.pdf; Author: CERN DEM JLC; CreateDate: 03.12.2007; LatestRevisionDate: 13.03.2008; Supplier Part Number: 2309111; Supplier: Farnell; RoHS: YES
R30 = R0603_5K49_0.1%_0.063W_10PPM: Resistor - 0.1%; Part Description: Thin Film Chip Resistor; Manufacturer: Yageo; Manufacturer Part Number: RC0603FR-075K49L; Manufacturer1 Part Number: RN73C1J5K49BTDF; Power: 0.063W; TC: ±10ppm; Tolerance: ±1%; Table: Resistors SMD; Power (Watts): 0.1W, 1/10W; Description: RES SMD 5.49K OHM 1% 1/10W 0603; Resistance (Ohms): 5.49k; Temperature Coefficient: ±100ppm/°C; Part Number: R0603_5K49_0.1%_0.063W_10PPM; Component Kind: Standard; Component Type: Standard; Pin Count: 2; Value: 5k49; Status: Not recommended; Case: 0603; Mounted: Yes; Socket: No; SMD: Yes; Manufacturer1 Example: TYCO HOLSWORTHY; Manufacturer1 ComponentHeight: 0.5mm; HelpURL: \\cern.ch\dfs\Applications\Altium\Datasheets\R0603_Tyco_RN73.pdf; Author: CERN DEM JLC; CreateDate: 3.12.2007; LatestRevisionDate: 13.03.2008; RoHS: RoHS Compliant; Package / Case: 0603 (1608 Metric); Category: Resistors; Operating Temperature: -55°C ~ 155°C; Supplier: Digi-Key; Size / Dimension: 0.063" L x 0.031" W (1.60mm x 0.80mm); Composition: Thick Film; Number of Terminations: 2; Packaging: Cut Tape (CT); Supplier Device Package: 0603; Supplier Part Number: 311-5.49KHRCT-ND; Features: Moisture Resistant; Height: 0.022" (0.55mm)
R31 = R0603_31K6_0.1%_0.063W_10PPM: Resistor - 0.1%; Part Description: Thin Film Chip Resistor; Manufacturer: Yageo; Manufacturer Part Number: RC0603FR-0731K6L; Manufacturer1 Part Number: RN73C1J31K6BTDF; Power: 0.063W; TC: ±10ppm; Tolerance: ±1%; Table: Resistors SMD; Description: RES SMD 31.6K OHM 1% 1/10W 0603; Power (Watts): 0.1W, 1/10W; Resistance (Ohms): 31.6k; Temperature Coefficient: ±100ppm/°C; Part Number: R0603_31K6_0.1%_0.063W_10PPM; Component Kind: Standard; Component Type: Standard; Pin Count: 2; Value: 31k6; Status: Not recommended; Case: 0603; Mounted: Yes; Socket: No; SMD: Yes; Manufacturer1 Example: TYCO HOLSWORTHY; Manufacturer1 ComponentHeight: 0.5mm; HelpURL: \\cern.ch\dfs\Applications\Altium\Datasheets\R0603_Tyco_RN73.pdf; Author: CERN DEM JLC; CreateDate: 03.12.2007; LatestRevisionDate: 13.03.2008; Composition: Thick Film; Number of Terminations: 2; Height: 0.022" (0.55mm); Size / Dimension: 0.063" L x 0.031" W (1.60mm x 0.80mm); Supplier Part Number: 311-31.6KHRCT-ND; Category: Resistors; Features: Moisture Resistant; Package / Case: 0603 (1608 Metric); Packaging: Cut Tape (CT); Supplier: Digi-Key; Supplier Device Package: 0603; RoHS: RoHS Compliant; Operating Temperature: -55°C ~ 155°C
R32 = R0603_240R_1%_0.1W_100PPM: Resistor - 1%; Part Description: General Purpose Thick Film Chip Resistor; Manufacturer: Yageo; Manufacturer Part Number: RC0603JR-07240RL; Manufacturer1 Part Number: NRC06F2400TRF; Power: 0.1W; TC: ±100ppm/°C; Tolerance: ±5%; Table: Resistors SMD; Description: RES SMD 240 OHM 5% 1/10W 0603; Power (Watts): 0.1W, 1/10W; Part Number: R0603_240R_1%_0.1W_100PPM; Component Kind: Standard; Component Type: Standard; Pin Count: 2; Value: 240; Status: Preferred; Case: 0603; Mounted: Yes; Socket: No; SMD: Yes; Manufacturer1 Example: NIC COMPONENT; Manufacturer1 ComponentHeight: 0.55mm; HelpURL: \\cern.ch\dfs\Applications\Altium\Datasheets\R0603_NIC_NRC.pdf; Author: CERN DEM JLC; CreateDate: 03.12.2007; LatestRevisionDate: 13.03.2008; Supplier Device Package: 0603; Temperature Coefficient: ±100ppm/°C; RoHS: RoHS Compliant; Category: Resistors; Supplier Part Number: 311-240GRCT-ND; Features: Moisture Resistant; Number of Terminations: 2; Height: 0.022" (0.55mm); Composition: Thick Film; Size / Dimension: 0.063" L x 0.031" W (1.60mm x 0.80mm); Package / Case: 0603 (1608 Metric); Packaging: Cut Tape (CT); Operating Temperature: -55°C ~ 155°C; Resistance (Ohms): 240; Supplier: Digi-Key
R41 = R0603_35K7_0.1%_0.063W_10PPM: Resistor - 0.1%; Part Description: Thin Film Chip Resistor; Manufacturer: VISHAY; Manufacturer Part Number: CRCW060335K7FKEA.; Manufacturer1 Part Number: RN73C1J35K7BTDF; Power: 0.063W; TC: ±10ppm; Table: Resistors SMD; Resistor Mounting: Surface Mount Device<!--FANDB--><div class="features-and-benefits-container"><div class="features-and-benefits-description"><span class="features-benefits-value">The Vishay D/CRCW e3 series are standard thick film chip resistors. The resistance range includes E96 and E24 decade values from 1ohm to 10Mohm. CRCW e3 series resistors have a pure tin solder contacts on the Ni barrier layer that provides compatibility with reflow soldering process.</span></div><div class="features-and-benefits-list"><ul class="features-and-benefits-list-list"><li class="features-and-benefits-list-item">Automotive grade AEC-Q200 qualified</li><li class="features-and-benefits-list-item">EIA 0402, 0603, 0805, 1206, 1210, 1218, 2010, 2512 standard case sizes available</li><li class="features-and-benefits-list-item">Stability &Delta; Resistance: 35.7; Resistor Element Material: Thick Film; Resistance Tolerance: ± 1%; Temperature Coefficient: ± 100; Voltage Rating: 75; Power Rating: 100; Resistor Case Style: 0603 [1608 Metric]; Product Range: AEC-Q200 CRCW Series; Description: VISHAY - CRCW060335K7FKEA. - RES, THICK FILM, 35K7, 1%, 0.1W, 0603; Part Number: R0603_35K7_0.1%_0.063W_10PPM; Component Kind: Standard; Component Type: Standard; Pin Count: 2; Value: 35k7; Status: Not recommended; Tolerance: ±0.1%; Case: 0603; Mounted: Yes; Socket: No; SMD: Yes; Manufacturer1 Example: TYCO HOLSWORTHY; Manufacturer1 ComponentHeight: 0.5mm; HelpURL: \\cern.ch\dfs\Applications\Altium\Datasheets\R0603_Tyco_RN73.pdf; Author: CERN DEM JLC; CreateDate: 3.12.2007; LatestRevisionDate: 13.03.2008; MSL: MSL 1 - Unlimited; Packaging: Cut Tape; Supplier Part Number: 2138458; RoHS: Y-EX; Supplier: Farnell
R42 = R0603_16K9_0.1%_0.063W_10PPM: Resistor - 0.1%; Part Description: Thin Film Chip Resistor; Manufacturer: Yageo; Manufacturer Part Number: RC0603FR-0716K9L; Manufacturer1 Part Number: RN73C1J16K9BTDF; Power: 0.063W; TC: ±10ppm; Tolerance: ±1%; Table: Resistors SMD; Resistance (Ohms): 16.9k; Power (Watts): 0.1W, 1/10W; Temperature Coefficient: ±100ppm/°C; Description: RES SMD 16.9K OHM 1% 1/10W 0603; Part Number: R0603_16K9_0.1%_0.063W_10PPM; Component Kind: Standard; Component Type: Standard; Pin Count: 2; Value: 16k9; Status: Not recommended; Case: 0603; Mounted: Yes; Socket: No; SMD: Yes; Manufacturer1 Example: TYCO HOLSWORTHY; Manufacturer1 ComponentHeight: 0.5mm; HelpURL: \\cern.ch\dfs\Applications\Altium\Datasheets\R0603_Tyco_RN73.pdf; Author: CERN DEM JLC; CreateDate: 3.12.2007; LatestRevisionDate: 13.03.2008; Operating Temperature: -55°C ~ 155°C; Features: Moisture Resistant; Supplier: Digi-Key; Supplier Device Package: 0603; Category: Resistors; Packaging: Cut Tape (CT); Package / Case: 0603 (1608 Metric); Height: 0.022" (0.55mm); RoHS: RoHS Compliant; Number of Terminations: 2; Size / Dimension: 0.063" L x 0.031" W (1.60mm x 0.80mm); Composition: Thick Film; Supplier Part Number: 311-16.9KHRCT-ND
R100 = R0603_8K66_0.1%_0.063W_10PPM: Resistor - 0.1%; Part Description: Thin Film Chip Resistor; Manufacturer: Yageo; Manufacturer Part Number: RC0603FR-078K66L; Manufacturer1 Part Number: RN73C1J8K66BTDF; Power: 0.063W; TC: ±10ppm; Tolerance: ±1%; Table: Resistors SMD; Description: RES SMD 8.66K OHM 1% 1/10W 0603; Temperature Coefficient: ±100ppm/°C; Resistance (Ohms): 8.66k; Power (Watts): 0.1W, 1/10W; Part Number: R0603_8K66_0.1%_0.063W_10PPM; Component Kind: Standard; Component Type: Standard; Pin Count: 2; Value: 8k66; Status: Not recommended; Case: 0603; Mounted: Yes; Socket: No; SMD: Yes; Manufacturer1 Example: TYCO HOLSWORTHY; Manufacturer1 ComponentHeight: 0.5mm; HelpURL: \\cern.ch\dfs\Applications\Altium\Datasheets\R0603_Tyco_RN73.pdf; Author: CERN DEM JLC; CreateDate: 3.12.2007; LatestRevisionDate: 13.03.2008; Composition: Thick Film; Height: 0.022" (0.55mm); Supplier: Digi-Key; Package / Case: 0603 (1608 Metric); Category: Resistors; Packaging: Cut Tape (CT); Supplier Part Number: 311-8.66KHRCT-ND; Operating Temperature: -55°C ~ 155°C; Features: Moisture Resistant; Size / Dimension: 0.063" L x 0.031" W (1.60mm x 0.80mm); Supplier Device Package: 0603; Number of Terminations: 2; RoHS: RoHS Compliant
R101 = R0603_16K2_0.1%_0.063W_10PPM: Resistor - 0.1%; Part Description: Thin Film Chip Resistor; Manufacturer: Yageo; Manufacturer Part Number: RC0603FR-0716K2L; Manufacturer1 Part Number: RN73C1J16K2BTDF; Power: 0.063W; TC: ±10ppm; Tolerance: ±1%; Table: Resistors SMD; Resistance (Ohms): 16.2k; Temperature Coefficient: ±100ppm/°C; Description: RES SMD 16.2K OHM 1% 1/10W 0603; Power (Watts): 0.1W, 1/10W; Part Number: R0603_16K2_0.1%_0.063W_10PPM; Component Kind: Standard; Component Type: Standard; Pin Count: 2; Value: 16k2; Status: Not recommended; Case: 0603; Mounted: Yes; Socket: No; SMD: Yes; Manufacturer1 Example: TYCO HOLSWORTHY; Manufacturer1 ComponentHeight: 0.5mm; HelpURL: \\cern.ch\dfs\Applications\Altium\Datasheets\R0603_Tyco_RN73.pdf; Author: CERN DEM JLC; CreateDate: 03.12.2007; LatestRevisionDate: 13.03.2008; Height: 0.022" (0.55mm); Supplier Device Package: 0603; Operating Temperature: -55°C ~ 155°C; Category: Resistors; Number of Terminations: 2; Supplier Part Number: 311-16.2KHRCT-ND; Supplier: Digi-Key; Size / Dimension: 0.063" L x 0.031" W (1.60mm x 0.80mm); Composition: Thick Film; Packaging: Cut Tape (CT); Package / Case: 0603 (1608 Metric); Features: Moisture Resistant; RoHS: RoHS Compliant
R102 = R0603_64K9_0.1%_0.063W_10PPM: Resistor - 0.1%; Part Description: Thin Film Chip Resistor; Manufacturer: Yageo; Manufacturer Part Number: RC0603FR-0764K9L; Manufacturer1 Part Number: RN73C1J64K9BTDF; Power: 0.063W; TC: ±10ppm; Tolerance: ±1%; Table: Resistors SMD; Temperature Coefficient: ±100ppm/°C; Power (Watts): 0.1W, 1/10W; Resistance (Ohms): 64.9k; Description: RES SMD 64.9K OHM 1% 1/10W 0603; Part Number: R0603_64K9_0.1%_0.063W_10PPM; Component Kind: Standard; Component Type: Standard; Pin Count: 2; Value: 64k9; Status: Not recommended; Case: 0603; Mounted: Yes; Socket: No; SMD: Yes; Manufacturer1 Example: TYCO HOLSWORTHY; Manufacturer1 ComponentHeight: 0.5mm; HelpURL: \\cern.ch\dfs\Applications\Altium\Datasheets\R0603_Tyco_RN73.pdf; Author: CERN DEM JLC; CreateDate: 03.12.2007; LatestRevisionDate: 13.03.2008; Packaging: Tape & Reel (TR); Supplier Device Package: 0603; Number of Terminations: 2; RoHS: RoHS Compliant; Composition: Thick Film; Size / Dimension: 0.063" L x 0.031" W (1.60mm x 0.80mm); Package / Case: 0603 (1608 Metric); Features: Moisture Resistant; Category: Resistors; Height: 0.022" (0.55mm); Operating Temperature: -55°C ~ 155°C; Supplier Part Number: 311-64.9KHRTR-ND; Supplier: Digi-Key
R104 = R0603_4K42_0.1%_0.063W_10PPM: Resistor - 0.1%; Part Description: Thin Film Chip Resistor; Manufacturer: Yageo; Manufacturer Part Number: RC0603FR-074K42L; Manufacturer1 Part Number: RN73C1J4K42BTDF; Power: 0.063W; TC: ±10ppm; Tolerance: ±1%; Table: Resistors SMD; Resistance (Ohms): 4.42k; Description: RES SMD 4.42K OHM 1% 1/10W 0603; Power (Watts): 0.1W, 1/10W; Temperature Coefficient: ±100ppm/°C; Part Number: R0603_4K42_0.1%_0.063W_10PPM; Component Kind: Standard; Component Type: Standard; Pin Count: 2; Value: 4k42; Status: Not recommended; Case: 0603; Mounted: Yes; Socket: No; SMD: Yes; Manufacturer1 Example: TYCO HOLSWORTHY; Manufacturer1 ComponentHeight: 0.5mm; HelpURL: \\cern.ch\dfs\Applications\Altium\Datasheets\R0603_Tyco_RN73.pdf; Author: CERN DEM JLC; CreateDate: 03.12.2007; LatestRevisionDate: 13.03.2008; Features: Moisture Resistant; Supplier Device Package: 0603; Category: Resistors; Packaging: Cut Tape (CT); Number of Terminations: 2; Package / Case: 0603 (1608 Metric); Supplier Part Number: 311-4.42KHRCT-ND; Size / Dimension: 0.063" L x 0.031" W (1.60mm x 0.80mm); Operating Temperature: -55°C ~ 155°C; Supplier: Digi-Key; Composition: Thick Film; RoHS: RoHS Compliant; Height: 0.022" (0.55mm)
R105 R106 = R0603_22K_1%_0.1W_100PPM: Resistor - 1%; Part Description: General Purpose Thick Film Chip Resistor; Manufacturer: Yageo; Manufacturer Part Number: RC0402JR-0722KL; Manufacturer1 Part Number: NRC06F2202TRF; Power: 0.1W; TC: ±100ppm/°C; Tolerance: ±5%; Table: Resistors SMD; Power (Watts): 0.063W, 1/16W; Description: RES SMD 22K OHM 5% 1/16W 0402; Part Number: R0603_22K_1%_0.1W_100PPM; Component Kind: Standard; Component Type: Standard; Pin Count: 2; Value: 22k; Status: Preferred; Case: 0603; Mounted: Yes; Socket: No; SMD: Yes; Manufacturer1 Example: NIC COMPONENT; Manufacturer1 ComponentHeight: 0.55mm; HelpURL: \\cern.ch\dfs\Applications\Altium\Datasheets\R0603_NIC_NRC.pdf; Author: CERN DEM JLC; CreateDate: 03.12.2007; LatestRevisionDate: 13.03.2008; Temperature Coefficient: ±100ppm/°C; Number of Terminations: 2; Operating Temperature: -55°C ~ 155°C; Supplier Device Package: 0402; Package / Case: 0402 (1005 Metric); Supplier: Digi-Key; Resistance (Ohms): 22k; Packaging: Cut Tape (CT); Composition: Thick Film; Category: Resistors; Height: 0.016" (0.40mm); Size / Dimension: 0.039" L x 0.020" W (1.00mm x 0.50mm); RoHS: RoHS Compliant; Supplier Part Number: 311-22KJRCT-ND; Features: Moisture Resistant
R107 = R0603_41K2_0.1%_0.063W_10PPM: Resistor - 0.1%; Part Description: Thin Film Chip Resistor; Manufacturer: Stackpole Electronics Inc.; Manufacturer Part Number: RMCF0603FT41K2; Manufacturer1 Part Number: RN73C1J41K2BTDF; Power: 0.063W; TC: ±10ppm; Tolerance: ±1%; Table: Resistors SMD; Power (Watts): 0.1W, 1/10W; Temperature Coefficient: ±100ppm/°C; Resistance (Ohms): 41.2k; Description: RES SMD 41.2K OHM 1% 1/10W 0603; Part Number: R0603_41K2_0.1%_0.063W_10PPM; Component Kind: Standard; Component Type: Standard; Pin Count: 2; Value: 41k2; Status: Not recommended; Case: 0603; Mounted: Yes; Socket: No; SMD: Yes; Manufacturer1 Example: TYCO HOLSWORTHY; Manufacturer1 ComponentHeight: 0.5mm; HelpURL: \\cern.ch\dfs\Applications\Altium\Datasheets\R0603_Tyco_RN73.pdf; Author: CERN DEM JLC; CreateDate: 03.12.2007; LatestRevisionDate: 13.03.2008; Supplier Part Number: RMCF0603FT41K2TR-ND; Operating Temperature: -55°C ~ 155°C; Package / Case: 0603 (1608 Metric); Features: Automotive AEC-Q200; Height: 0.022" (0.55mm); RoHS: RoHS Compliant; Category: Resistors; Supplier Device Package: 0603; Supplier: Digi-Key; Number of Terminations: 2; Composition: Thick Film; Packaging: Tape & Reel (TR); Size / Dimension: 0.061" L x 0.031" W (1.55mm x 0.80mm)